# EAGLE design ace128_pcf8574_qwiic_v1 (EAGLE 9.2.2)
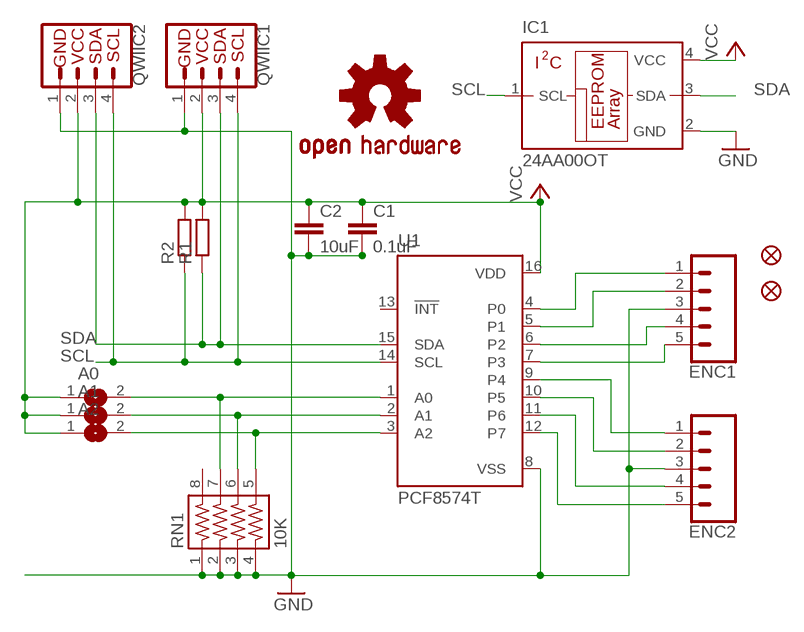
[diagram p0: schematic, sheet 1]

## Parts
A0  SJ  [SJ]
A1  SJ  [SJ]
A2  SJ  [SJ]
C1  0.1uF  C-EUC0603  [C0603]
C2  10uF  C-EUC0805  [C0805]
ENC1  CONN_05  [1X05]
ENC2  CONN_05  [1X05]
FD1  FIDUCIAL1X2  [FIDUCIAL-1X2]
FD2  FIDUCIAL1X2  [FIDUCIAL-1X2]
IC1  24AA00OT  [SOT23-5L]
LOGO1  OSHW-LOGOS  [OSHW-LOGO-S]
QWIIC1  QWIIC_CONNECTORJS-1MM  [1X04_1MM_RA]
QWIIC2  QWIIC_CONNECTORJS-1MM  [1X04_1MM_RA]
R1  R-EU_0207/2V  [0207/2V]
R2  R-EU_0207/2V  [0207/2V]
RN1  10K  743-8  [743-8]
U1  PCF8574T  [SO16W]

## Nets
A0: A0.2 RN1.7 U1.1(A0)
A1: A1.2 RN1.6 U1.2(A1)
A2: A2.2 RN1.5 U1.3(A2)
GND: C1.2 C2.2 ENC1.3 ENC2.3 IC1.2(GND) QWIIC1.1(GND) QWIIC2.1(GND) RN1.1 RN1.2 RN1.3 RN1.4 U1.8(VSS)
P0: ENC1.1 U1.4(P0)
P1: ENC1.2 U1.5(P1)
P2: ENC1.4 U1.6(P2)
P3: ENC1.5 U1.7(P3)
P4: ENC2.1 U1.9(P4)
P5: ENC2.2 U1.10(P5)
P6: ENC2.4 U1.11(P6)
P7: ENC2.5 U1.12(P7)
SCL: IC1.1(SCL) QWIIC1.4(SCL) QWIIC2.4(SCL) R2.1 U1.14(SCL)
SDA: IC1.3(SDA) QWIIC1.3(SDA) QWIIC2.3(SDA) R1.1 U1.15(SDA)
VCC: A0.1 A1.1 A2.1 C1.1 C2.1 IC1.4(VCC) QWIIC1.2(VCC) QWIIC2.2(VCC) R1.2 R2.2 U1.16(VDD)
Unconnected: RN1.8 U1.13(!INT)

## Library data of the parts
A0 A1 A2 = jumper:SJ: SMD solder JUMPER
C1 C2 = rcl:C-EU: CAPACITOR, European symbol
ENC1 ENC2 = SparkFun-Connectors:CONN_05: Multi connection point. Often used as Generic Header-pin footprint for 0.1 inch spaced/style header connections On any of the 0.1 inch spaced packages, you can populate with these: Break Away Headers - Straight <https://www.sparkfun.com/products/116> (PRT-00116) Break Away Male Headers - Right Angle <https://www.sparkfun.com/products/553> (PRT-00553) Female Headers <https://www.sparkfun.com/products/115> (PRT-00115) Break Away Headers - Machine Pin <https://www.sparkfun.com/products/117> (PRT-00117) Break Away Female Headers - Swiss Machine Pin <https://www.sparkfun.com/products/743> (PRT-00743) For SCREWTERMINALS and SPRING TERMINALS visit here: Screw Terimnals on SparkFun.com <https://www.sparkfun.com/search/results?term=Screw+Terminals> (5mm/3.5mm/2.54mm spacing) This device is also useful as a general connection point to wire up your design to another part of your project. Our various solder wires solder well into these plated through hole pads. Hook-Up Wire - Assortment (Stranded, 22 AWG) <https://www.sparkfun.com/products/11375> (PRT-11375) Hook-Up Wire - Assortment (Solid Core, 22 AWG) <https://www.sparkfun.com/products/11367> (PRT-11367) View the entire wire category on our website here <https://www.sparkfun.com/categories/141> Special notes: Molex polarized connector foot print use with SKU : PRT-08231 with associated crimp pins and housings. 1MM SMD Version SKU: PRT-10208
FD1 FD2 = SparkFun-Aesthetics:FIDUCIAL: Fiducial Alignment Points Point-of-reference for pick-and-place machines and other optical instruments.
IC1 = microchip:24*00: Serial EEPROM 128 bit, I2C (AA = 1.8 V/LC = 2.5 V/C = 5.0 V); MF: MICROCHIP; MPN: 24AA00T-I/OTG; OC_FARNELL: 1331264; OC_NEWARK: 89H3038
LOGO1 = SparkFun-Aesthetics:OSHW-LOGO: Open-Source Hardware (OSHW) Logo This logo indicates the piece of hardware it is found on incorporates a OSHW license and/or adheres to the definition of open source hardware found here: http://freedomdefined.org/OSHW
QWIIC1 QWIIC2 = SparkFun-Connectors:QWIIC_CONNECTOR: SparkFun I2C Standard Qwiic Connector An SMD 1mm pitch JST connector makes it easy and quick (get it? Qwiic?) to connect I2C devices to each other. The Qwiic system <http://www.sparkfun.com/qwiic> enables fast and solderless connection between popular platforms and various sensors and actuators. We carry 200mm <https://www.sparkfun.com/products/14204>, 100mm <https://www.sparkfun.com/products/14205>, 50mm <https://www.sparkfun.com/products/14206>, and breadboard friendly <https://www.sparkfun.com/products/14207> Qwiic cables. We also offer 10 pcs strips <https://www.sparkfun.com/products/14323> the SMD connectors.
R1 R2 = rcl:R-EU_: RESISTOR, European symbol
RN1 = resistor-array:743-8: CTS 743 Series 8 Terminations, 4 Resistors
U1 = micro-philips:PCF8574: I2C-Bus Remote 8-bit I/O expander http://www.semiconductors.philips.com/acrobat_download/datasheets/PCF8574_4.pdf; MPN: PCF8574T/3,512; OC_FARNELL: 1201255; OC_NEWARK: 70R6870

## Board
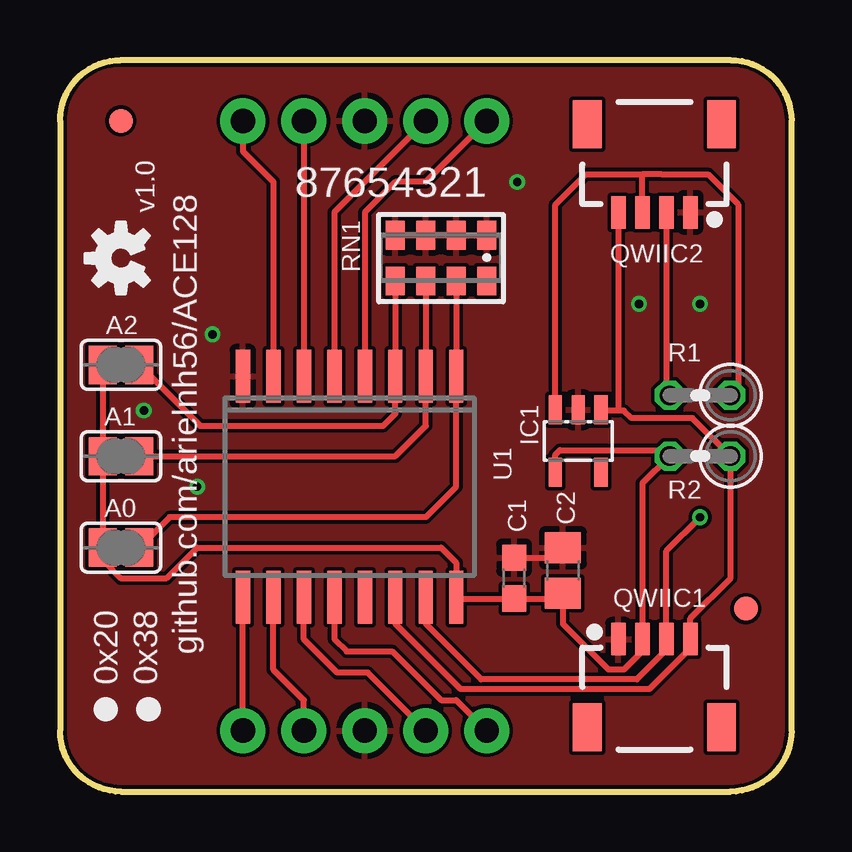
[diagram p1: board, top side]
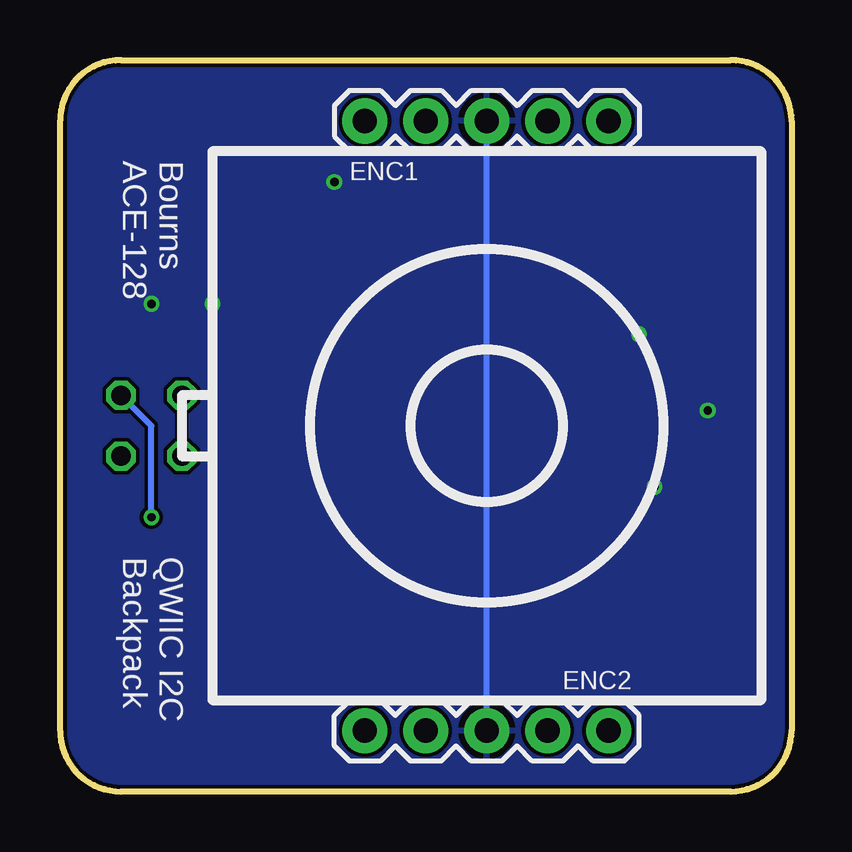
[diagram p2: board, bottom side, seen from below]

Size 30.48 x 30.48 mm. Coordinates in mm from the lower left corner, seen from the top.
Outline: 2.54,0 27.94,0 arc90 30.48,2.54 30.48,27.94 arc90 27.94,30.48 2.54,30.48 arc90 0,27.94 0,2.54 arc90 2.54,0
Copper layers (1*16): Top 0.035mm / dielectric 1.5mm / Bottom 0.035mm
Design rules "SparkFun-2-layer-PCBWay-LIMIT": minimum track width 6mil, minimum drill 0.3mm, track to track 6mil, track to pad 6mil, pad to pad 6mil, via to via 6mil, smd to smd 6mil, copper to edge 6mil, drill to drill 6mil, minimum pad ring 6mil, minimum via ring 6mil, stop-mask expansion 4mil, vias tented up to drill 25mil, thermal gap 10mil

### Footprints (pad centres in the part's own frame; a part is rotated, then mirrored left to right if it is on the bottom)
SJ = smd 1.168 x 1.6: 1 -0.762,0; 2 0.762,0
C0603 = smd 1.1 x 1: 1 -0.85,0; 2 0.85,0
C0805 = smd 1.3 x 1.5: 1 -0.95,0; 2 0.95,0
1X05 = drill 1.016 pad 1.88: 1 0,0; 2 2.54,0; 3 5.08,0; 4 7.62,0; 5 10.16,0
FIDUCIAL-1X2 = smd 1 x 1: 1 0,0
SOT23-5L = smd 0.55 x 1.2: 1 -0.95,-1.3; 2 0,-1.3; 3 0.95,-1.3; 4 0.95,1.3; 5 -0.95,1.3
1X04_1MM_RA = smd 0.6 x 1.35: 1 -1.5,0; 2 -0.5,0; 3 0.5,0; 4 1.5,0 | smd 1.2 x 2: NC1 2.8,-3.675; NC2 -2.8,-3.675
0207/2V = drill 0.813 octagon: 1 -1.27,0; 2 1.27,0
743-8 = smd 0.8 x 1.2: 1 -1.905,-0.953; 2 -0.635,-0.953; 3 0.635,-0.953; 4 1.905,-0.953; 5 1.905,0.953; 6 0.635,0.953; 7 -0.635,0.953; 8 -1.905,0.953
SO16W = smd 0.6 x 2.2: 1 -4.445,-4.6; 2 -3.175,-4.6; 3 -1.905,-4.6; 4 -0.635,-4.6; 5 0.635,-4.6; 6 1.905,-4.6; 7 3.175,-4.6; 8 4.445,-4.6; 9 4.445,4.6; 10 3.175,4.6; 11 1.905,4.6; 12 0.635,4.6; 13 -0.635,4.6; 14 -1.905,4.6; 15 -3.175,4.6; 16 -4.445,4.6

### Placement (x,y rotation side)
A0  2.54,10.16 0 top
A1  2.54,13.97 0 top
A2  2.54,17.78 0 top
C1  18.92,8.89 90 top
C2  20.95,9.21 90 top
ENC1  17.78,27.94 0 bottom
ENC2  7.62,2.54 180 bottom
FD1  2.54,27.94 0 top
FD2  28.57,7.62 0 top
IC1  21.59,14.61 180 top
LOGO1  2.54,22.23 90 top
QWIIC1  24.77,6.35 0 top
QWIIC2  24.77,24.13 180 top
R1  26.67,16.51 180 top
R2  26.67,13.97 180 top
RN1  15.88,22.23 180 top
U1  12.06,12.7 180 top

### Tracks (layer width: path | path; a pad name or v marks a point on that pad's centre or on a via)
A0
  Top 0.254: RN1.7 U1.1 16.51,12.7 15.24,11.43 4.57,11.43 A0.2
A1
  Top 0.254: RN1.6 U1.2 15.24,15.24 13.97,13.97 A1.2
A2
  Top 0.254: RN1.5 U1.3 13.97,15.75 13.46,15.24 5.84,15.24 A2.2
GND  (via drill 0.35)
  Top 0.254: RN1.1 RN1.2 RN1.3 RN1.4 | C1.2 20.54,9.74 C2.2
  Bottom 0.254: ENC2.3 ENC1.3
  other vias: 3.49,15.88 5.71,12.7 24.13,20.32 26.67,20.32 6.35,19.05 19.05,25.4
  pour Top: 0,30.48 0,0 30.48,0 30.48,30.48
  pour Bottom: 0,30.48 30.48,30.48 30.48,0 0,0
P0
  Top 0.254: ENC1.1 15.24,25.4 13.97,25.4 12.7,24.13 U1.4
P1
  Top 0.254: ENC1.2 11.43,24.13 U1.5
P2
  Top 0.254: ENC1.4 U1.6
P3
  Top 0.254: ENC1.5 7.62,26.67 8.89,25.4 U1.7
P4
  Top 0.254: ENC2.1 U1.9
P5
  Top 0.254: ENC2.2 10.16,3.81 8.89,5.08 U1.10
P6
  Top 0.254: ENC2.4 12.83,4.95 11.56,4.95 10.16,6.35 U1.11
P7
  Top 0.254: U1.12 11.43,6.35 11.94,5.84 13.84,5.84 15.88,3.81 16.51,3.81 ENC2.5
SCL
  Top 0.254: U1.14 13.97,6.99 16.69,4.27 24.55,4.27 26.45,6.17 QWIIC1.4 26.27,7.21 27.94,8.89 R2.1 26.35,15.56 23.81,15.56 23.5,15.88 23.27,15.88 | IC1.1 22.57,15.88 23.27,15.88 | QWIIC2.4 23.27,15.88
SDA  (via drill 0.35)
  Top 0.254: U1.15 15.24,6.99 17.55,4.67 24.04,4.67 25.27,5.9 QWIIC1.3 25.27,10.03 v26.67,11.43 | R1.1 28.26,16.83 28.26,24.46 27,25.72 25.4,25.72 25.08,25.72 24.27,25.72 | IC1.3 20.64,24.45 21.91,25.72 24.27,25.72 | QWIIC2.3 24.27,25.72
  Bottom 0.254: v26.67,11.43 26.67,15.24 R1.1
VCC
  Top 0.254: A2.1 A1.1 A0.1 1.91,10.03 1.91,9.53 2.54,8.89 4.45,8.89 5.71,10.16 15.88,10.16 16.51,9.53 U1.16 16.67,7.94 16.77,8.04 C1.1 20.74,8.04 C2.1 20.95,6.99 22.86,5.08 23.5,5.08 24.27,5.85 QWIIC1.2 24.27,12.84 R2.2 25.15,14.22 20.83,14.22 20.64,14.04 IC1.4 | QWIIC2.2 25.27,16.64 R1.2
  Bottom 0.254: R1.2 R2.2

### Text on the board
tPlace: 87654321 | v1.0 | github.com/arielnh56/ACE128 | 0x20 | 0x38
bPlace: Bourns / ACE-128 | QWIIC I2C / Backpack